# Altium schematic sheet WikiHub-Mini.SchDoc
size A3
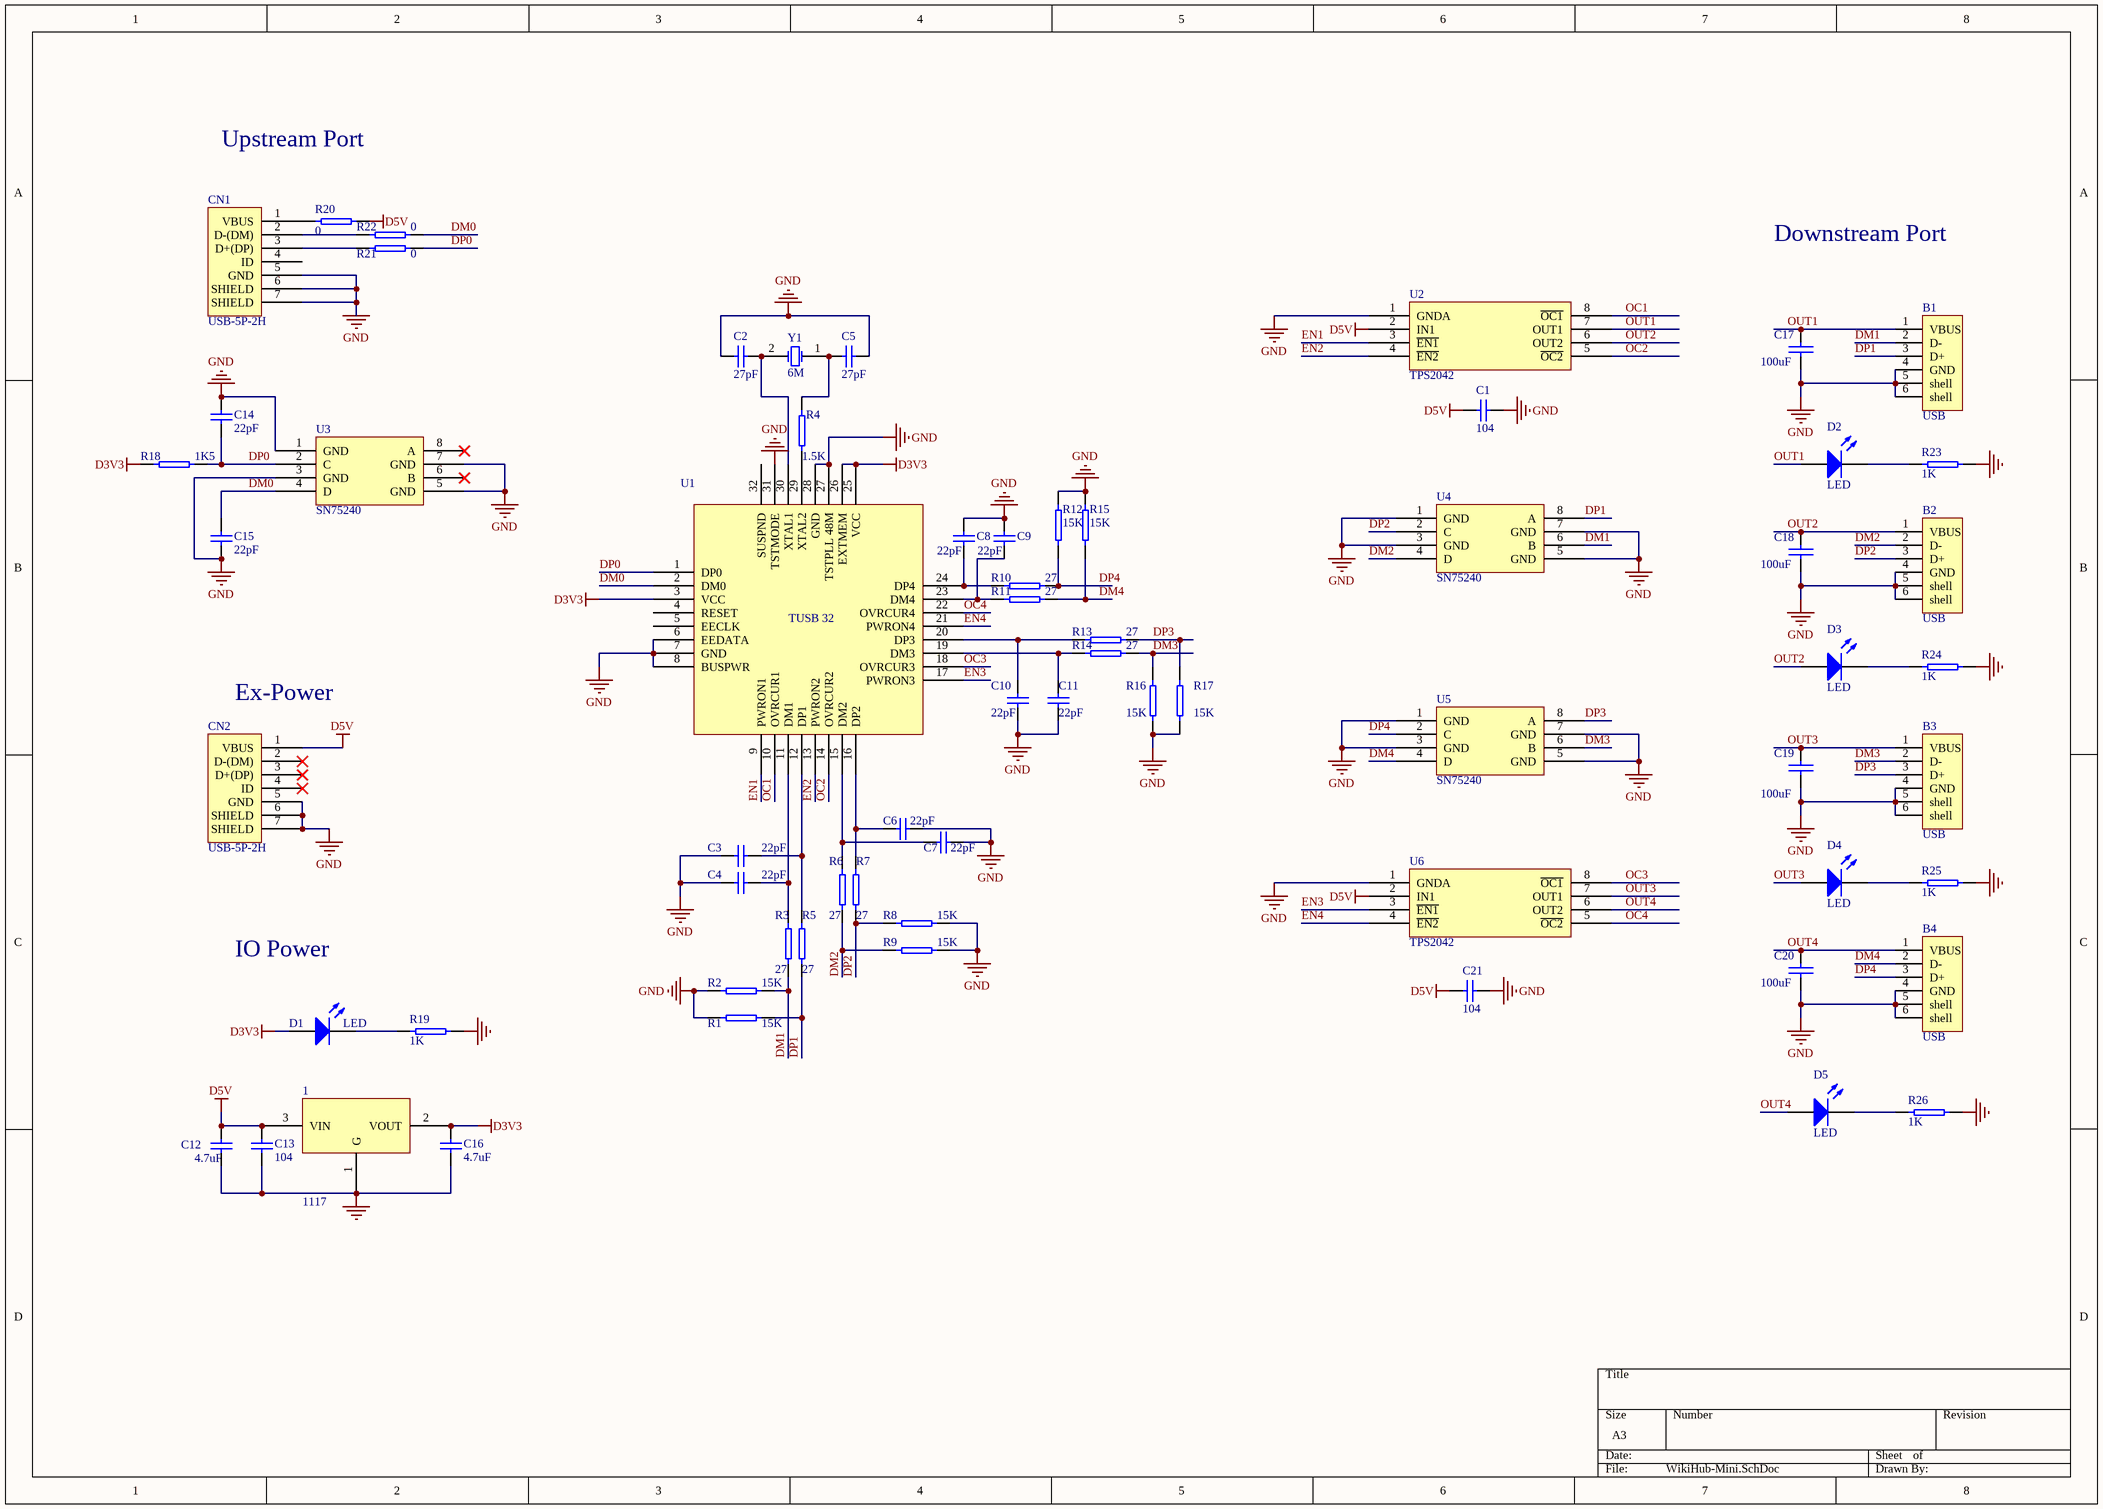
[diagram p0: WikiHub-Mini.SchDoc]

## Parts
1  1117  [1117]
B1  USB  [USB-A-Female-T2-Lite]
B2  USB  [USB-A-Female-T2-Lite]
B3  USB  [USB-A-Female-T2-Lite]
B4  USB  [USB-A-Female-T2-Lite]
C1  value 104  [C0603L]  (hidden comment: Cap)
C2  27pF  [C0603L]
C3  22pF  [C0603L]
C4  22pF  [C0603L]
C5  27pF  [C0603L]
C6  22pF  [C0603L]
C7  22pF  [C0603L]
C8  22pF  [C0603L]
C9  22pF  [C0603L]
C10  22pF  [C0603L]
C11  22pF  [C0603L]
C12  value 4.7uF  [C0603L]  (hidden comment: Cap)
C13  value 104  [C0603L]  (hidden comment: Cap)
C14  22pF  [C0603L]
C15  22pF  [C0603L]
C16  value 4.7uF  [C0603L]  (hidden comment: Cap)
C17  100uF  [1210]
C18  100uF  [1210]
C19  100uF  [1210]
C20  100uF  [1210]
C21  value 104  [C0603L]  (hidden comment: Cap)
CN1  USB-5P-2H  [USB-B-MICRO-Female-T3]
CN2  USB-5P-2H  [USB-B-MICRO-Female-T3]
D1  LED  [0603pn]
D2  LED  [0603pn]
D3  LED  [0603pn]
D4  LED  [0603pn]
D5  LED  [0603pn]
R1  15K  [R0603]
R2  15K  [R0603]
R3  27  [R0603]
R4  1.5K  [R0603]
R5  27  [R0603]
R6  27  [R0603]
R7  27  [R0603]
R8  15K  [R0603]
R9  15K  [R0603]
R10  27  [R0603]
R11  27  [R0603]
R12  15K  [R0603]
R13  27  [R0603]
R14  27  [R0603]
R15  15K  [R0603]
R16  15K  [R0603]
R17  15K  [R0603]
R18  1K5  [R0603]
R19  1K  [R0603]
R20  0  [R0603]
R21  0  [R0603]
R22  0  [R0603]
R23  1K  [R0603]
R24  1K  [R0603]
R25  1K  [R0603]
R26  1K  [R0603]
U1  TUSB 32  [TQFP32]
U2  TPS2042  [SO8W_M]
U3  SN75240  [SOP8 - 0.65]
U4  SN75240  [SOP8 - 0.65]
U5  SN75240  [SOP8 - 0.65]
U6  TPS2042  [SO8W_M]
Y1  6M  [XTAL]

## Nets
D3V3: 1.2(VOUT) C16.2 D1.1(A) R18.2 U1.3(VCC) U1.25(VCC) U1.26(EXTMEM)
D5V: 1.3(VIN) C1.2 C12.2 C13.2 C21.2 CN2.1(VBUS) R20.1 U2.2(IN1) U6.2(IN1)
GND: 1.1(G) B1.4(GND) B1.5(shell) B1.6(shell) B2.4(GND) B2.5(shell) B2.6(shell) B3.4(GND) B3.5(shell) B3.6(shell) B4.4(GND) B4.5(shell) B4.6(shell) C1.1 C2.2 C3.1 C4.1 C5.2 C6.2 C7.2 C8.2 C9.2 C10.1 C11.1 C12.1 C13.1 C14.1 C15.2 C16.1 C17.2 C18.2 C19.2 C20.2 C21.1 CN1.5(GND) CN1.6(SHIELD) CN1.7(SHIELD) CN2.5(GND) CN2.6(SHIELD) CN2.7(SHIELD) R1.2 R2.2 R8.1 R9.1 R12.1 R15.1 R16.2 R17.2 R19.1 R23.1 R24.1 R25.1 R26.1 U1.6(EEDATA) U1.7(GND) U1.8(BUSPWR) U1.27(TSTPLL_48M) U1.28(GND) U1.31(TSTMODE) U2.1(GNDA) U3.1(GND) U3.3(GND) U3.5(GND) U3.7(GND) U4.1(GND) U4.3(GND) U4.5(GND) U4.7(GND) U5.1(GND) U5.3(GND) U5.5(GND) U5.7(GND) U6.1(GNDA)
DM0: C15.1 R22.1 U1.2(DM0) U3.4(D)
DM1: B1.2(D-) R2.1 R3.1 U4.6(B)
DM2: B2.2(D-) R6.1 R9.2 U4.4(D)
DM3: B3.2(D-) R14.1 R16.1 U5.6(B)
DM4: B4.2(D-) R11.1 R15.2 U5.4(D)
DP0: C14.2 R18.1 R21.1 U1.1(DP0) U3.2(C)
DP1: B1.3(D+) R1.1 R5.1 U4.8(A)
DP2: B2.3(D+) R7.1 R8.2 U4.2(C)
DP3: B3.3(D+) R13.1 R17.1 U5.8(A)
DP4: B4.3(D+) R10.1 R12.2 U5.2(C)
EN1: U1.9(PWRON1) U2.3(~{EN1})
EN2: U1.13(PWRON2) U2.4(~{EN2})
EN3: U1.17(PWRON3) U6.3(~{EN1})
EN4: U1.21(PWRON4) U6.4(~{EN2})
OC1: U1.10(OVRCUR1) U2.8(~{OC1})
OC2: U1.14(OVRCUR2) U2.5(~{OC2})
OC3: U1.18(OVRCUR3) U6.8(~{OC1})
OC4: U1.22(OVRCUR4) U6.5(~{OC2})
OUT1: B1.1(VBUS) C17.1 D2.1(A) U2.7(OUT1)
OUT2: B2.1(VBUS) C18.1 D3.1(A) U2.6(OUT2)
OUT3: B3.1(VBUS) C19.1 D4.1(A) U6.7(OUT1)
OUT4: B4.1(VBUS) C20.1 D5.1(A) U6.6(OUT2)
NetC2_1: C2.1 U1.30(XTAL1) Y1.2(OSC2)
NetC3_2: C3.2 R5.2 U1.12(DP1)
NetC4_2: C4.2 R3.2 U1.11(DM1)
NetC5_1: C5.1 R4.1 Y1.1(OSC1)
NetC6_1: C6.1 R7.2 U1.16(DP2)
NetC7_1: C7.1 R6.2 U1.15(DM2)
NetC8_1: C8.1 R10.2 U1.24(DP4)
NetC9_1: C9.1 R11.2 U1.23(DM4)
NetC10_2: C10.2 R13.2 U1.20(DP3)
NetC11_2: C11.2 R14.2 U1.19(DM3)
NetCN1_1: CN1.1(VBUS) R20.2
NetCN1_2: CN1.2(D-(DM)) R22.2
NetCN1_3: CN1.3(D+(DP)) R21.2
NetD1_2: D1.2(K) R19.2
NetD2_2: D2.2(K) R23.2
NetD3_2: D3.2(K) R24.2
NetD4_2: D4.2(K) R25.2
NetD5_2: D5.2(K) R26.2
NetR4_2: R4.2 U1.29(XTAL2)

Not connected (* = marked no-connect by the designer): CN1 4(ID); CN2 2(D-(DM))* 3(D+(DP))* 4(ID)*; U1 4(RESET) 5(EECLK) 32(SUSPND); U3 6(B)* 8(A)*

## Notes on the sheet
- Upstream Port
- Downstream Port
- (near CN2) Ex-Power
- IO Power

## Library data of the parts
1 = 117
C1 C12 C13 C16 C21 = Cap: Capacitor; Published: 8-Jun-2000; LatestRevisionDate: 17-Jul-2002; LatestRevisionNote: Re-released for DXP Platform.; PackageReference: RAD-0.3; Publisher: Altium Limited
C2-C11 C14 C15 = Cap: Capacitor; Value: 22P; Published: 8-Jun-2000; LatestRevisionDate: 17-Jul-2002; LatestRevisionNote: Re-released for DXP Platform.; PackageReference: RAD-0.3; Publisher: Altium Limited
C17-C20 = CAP: Capacitor
CN1 CN2 = USB-5P-2H: USB-M5P-2H
D1-D5 = LED0: Typical INFRARED GaAs LED; Published: 8-Jun-2000; LatestRevisionDate: 08-Jul-2005; LatestRevisionNote: Mech Layer 1 removed.; PackageReference: LED-0; Publisher: Altium Limited
R1-R26 = RES
Y1 = XTAL: Crystal Oscillator; Published: 8-Jun-2000; LatestRevisionDate: 17-Jul-2002; LatestRevisionNote: Re-released for DXP Platform.; PackageReference: R38; Publisher: Altium Limited